# EAGLE design MRCS-ODX4 v17 (EAGLE 7.7.0)
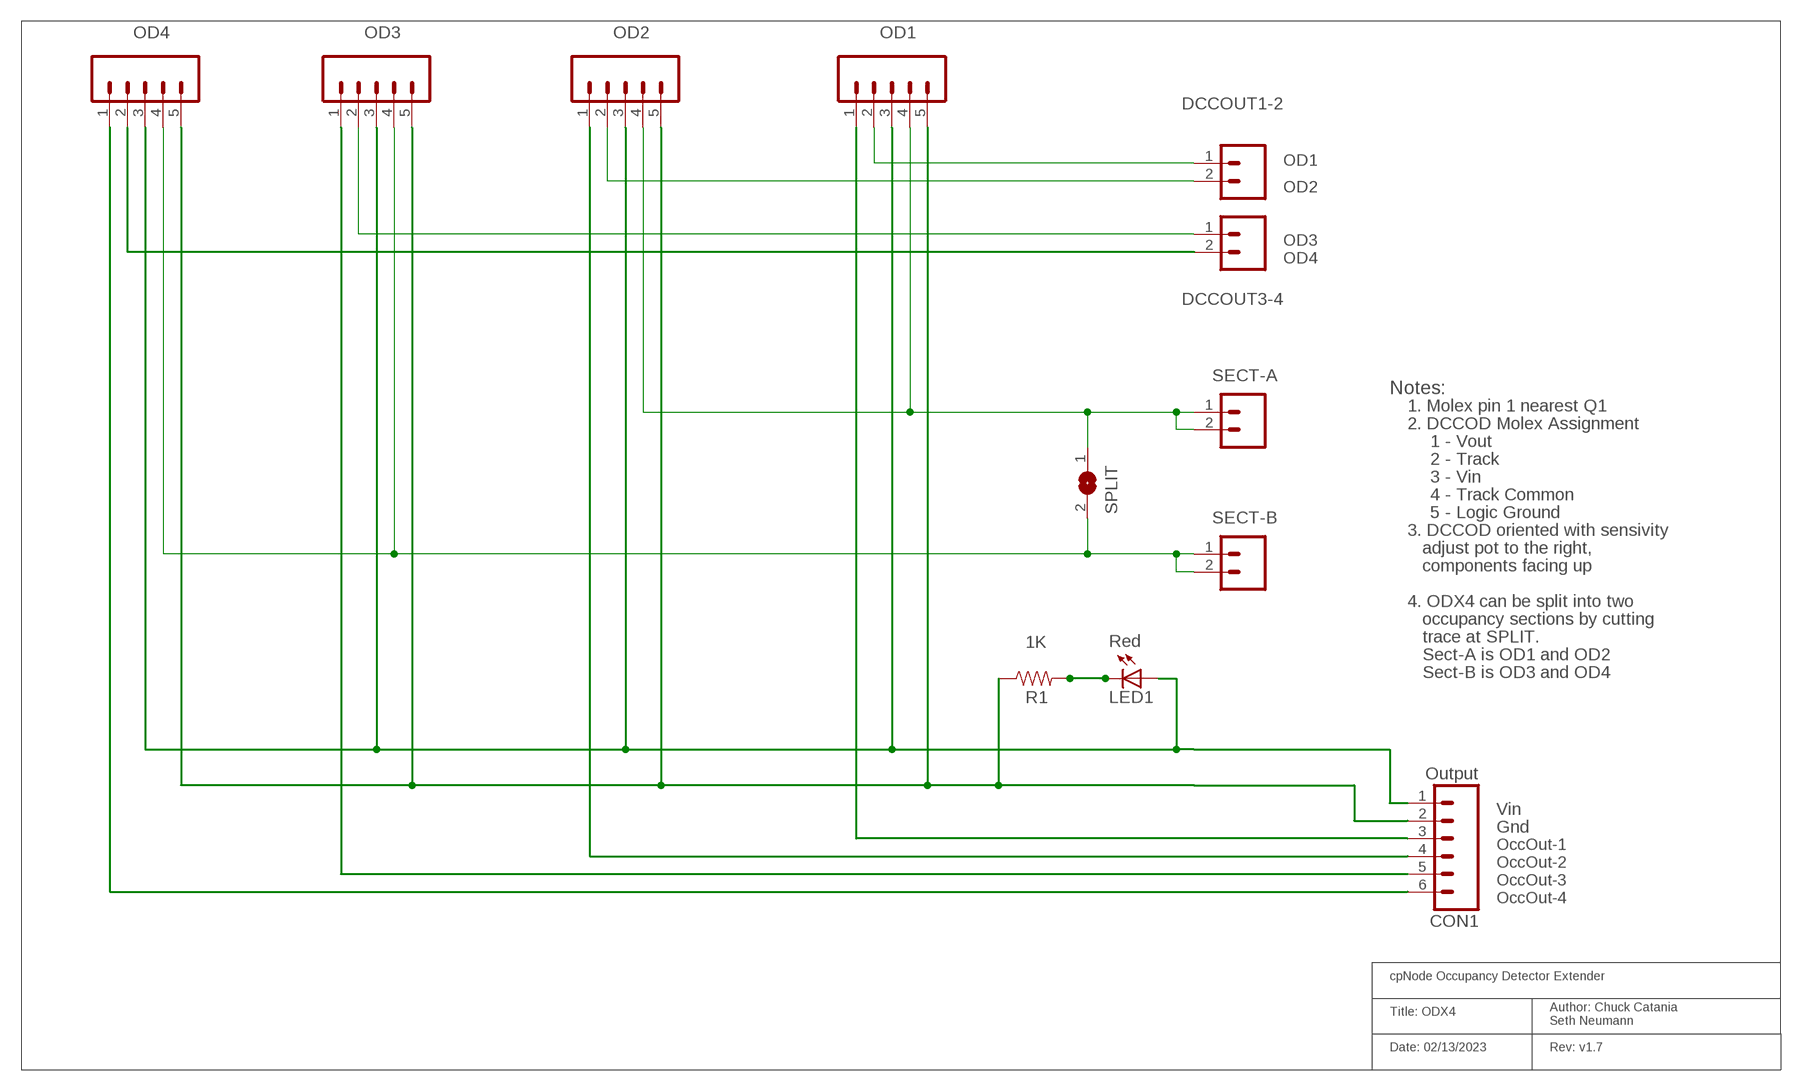
[diagram p0: schematic, sheet 1]

## Parts
CON1  Output  CONNECTOR-M06POLAR_LOCK  [MOLEX-1X6_LOCK]
DCCOUT1-2  CONNECTOR-M025MM-LOCK  [SCREWTERMINAL-5MM-2]
DCCOUT3-4  CONNECTOR-M025MM-LOCK  [SCREWTERMINAL-5MM-2]
LED1  Red  LEDLED3MM  [LED3MM]
OD1  M05PTH_LONGPADS  [1X05_LONGPADS]
OD2  M05PTH_LONGPADS  [1X05_LONGPADS]
OD3  M05PTH_LONGPADS  [1X05_LONGPADS]
OD4  M05PTH_LONGPADS  [1X05_LONGPADS]
R1  1K  RPTH04  [AXIAL-0.4-RES]
SECT-A  M025MM  [SCREWTERMINAL-5MM-2]
SECT-B  M025MM  [SCREWTERMINAL-5MM-2]
SPLIT  SJW  [SJW]

## Nets
GND: CON1.2 OD1.5 OD2.5 OD3.5 OD4.5 R1.P$1
N$1: DCCOUT3-4.2(B) OD4.2
N$2: CON1.3 OD1.1
N$3: DCCOUT1-2.1(A) OD1.2
N$4: DCCOUT1-2.2(B) OD2.2
N$6: LED1.K(C) R1.P$2
N$7: CON1.6 OD4.1
N$11: OD3.4 OD4.4 SECT-B.1 SECT-B.2 SPLIT.2
N$12: OD1.4 OD2.4 SECT-A.1 SECT-A.2 SPLIT.1
N$13: CON1.4 OD2.1
N$14: DCCOUT3-4.1(A) OD3.2
N$15: CON1.5 OD3.1
VIN: CON1.1 LED1.A OD1.3 OD2.3 OD3.3 OD4.3

## Notes on the sheet
- OD1
- OD2
- OD3
- OD4
- Notes:
- 1. Molex pin 1 nearest Q1
- 2. DCCOD Molex Assignment
- 1 - Vout
- 2 - Track
- 3 - Vin
- 4 - Track Common
- 5 - Logic Ground
- 3. DCCOD oriented with sensivity
- adjust pot to the right,
- components facing up
- 4. ODX4 can be split into two
- occupancy sections by cutting
- trace at SPLIT.
- Sect-A is OD1 and OD2
- Sect-B is OD3 and OD4
- Vin
- Gnd
- OccOut-1
- OccOut-2
- OccOut-3
- OccOut-4
- cpNode Occupancy Detector Extender
- Title: ODX4
- Author: Chuck Catania
  Seth Neumann
- Date: 02/13/2023 | Rev: v1.7

## Library data of the parts
CON1 = SPCoast:CONNECTOR-M06: Header 6 Standard 6-pin 0.1" header
DCCOUT1-2 DCCOUT3-4 = SPCoast:CONNECTOR-M02: PHOENIX CONNECTOR
LED1 = SPCoast:LED*
OD1-OD4 = SparkFun:M05: Header 5 Standard 5-pin 0.1" header. Use with straight break away headers (SKU : PRT-00116), right angle break away headers (PRT-00553), swiss pins (PRT-00743), machine pins (PRT-00117), and female headers (PRT-00115). Molex polarized connector foot print use with SKU : PRT-08230 with associated crimp pins and housings.
R1 = SPCoast:R*: Resistor Basic schematic elements and footprints for 0603, 1206, and PTH 1/10th watt (small) resistors.
SECT-A SECT-B = SparkFun-Connectors:M02: Standard 2-pin 0.1" header. Use with - straight break away headers ( PRT-00116) - right angle break away headers (PRT-00553) - swiss pins (PRT-00743) - machine pins (PRT-00117) - female headers (PRT-00115) Molex polarized connector foot print use with: PRT-08233 with associated crimp pins and housings. 2.54_SCREWTERM for use with PRT-10571. 3.5mm Screw Terminal footprints for PRT-08084 5mm Screw Terminal footprints for use with PRT-08433
SPLIT = jumper:SJ: SMD solder JUMPER

## Board
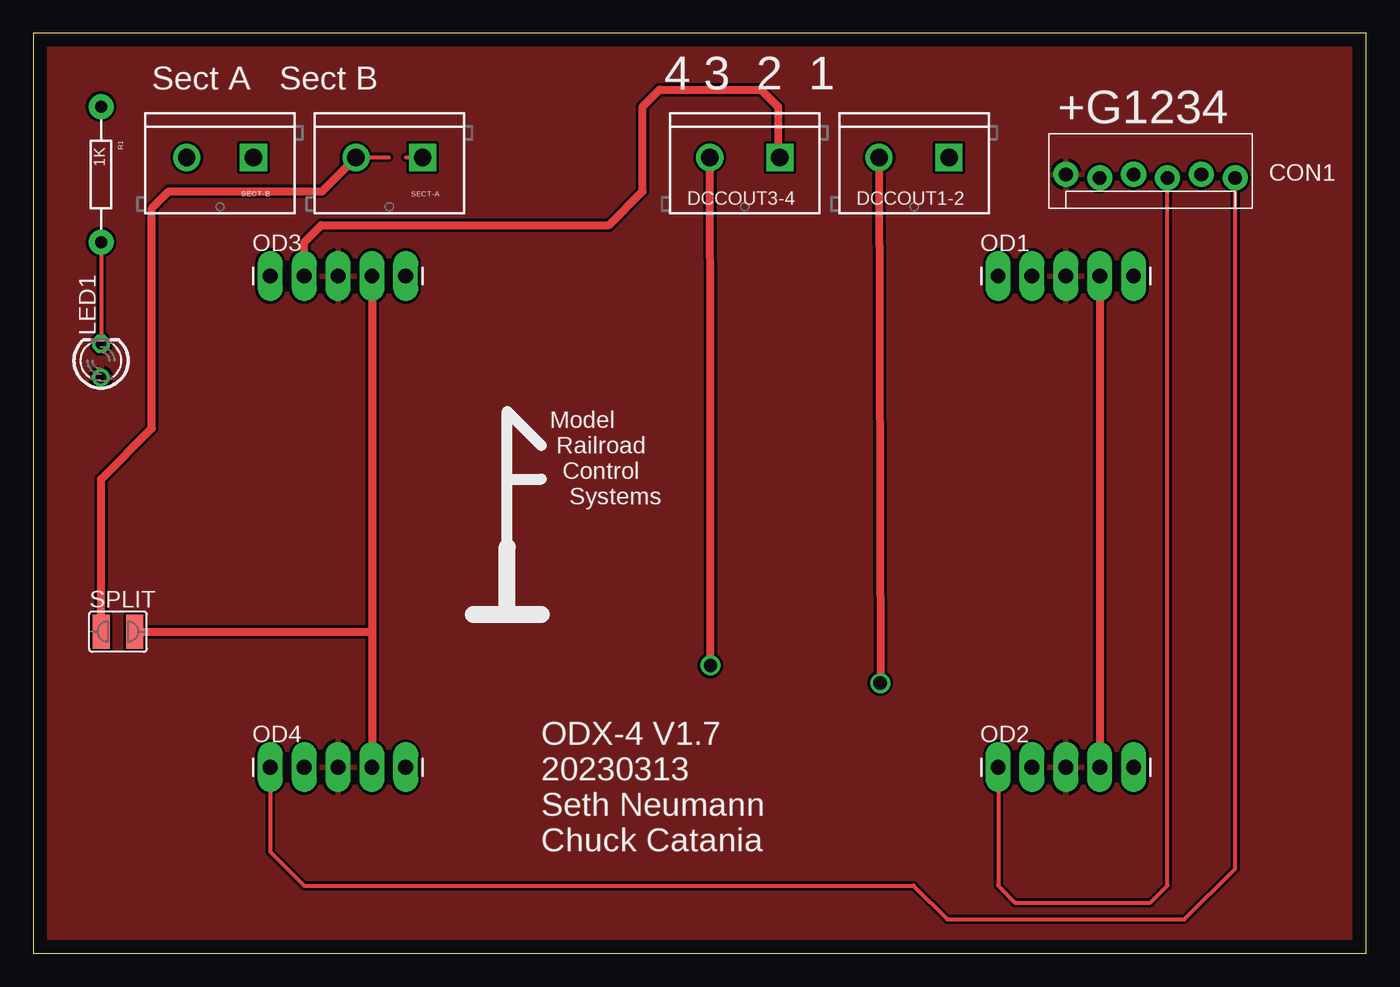
[diagram p1: board, top side]
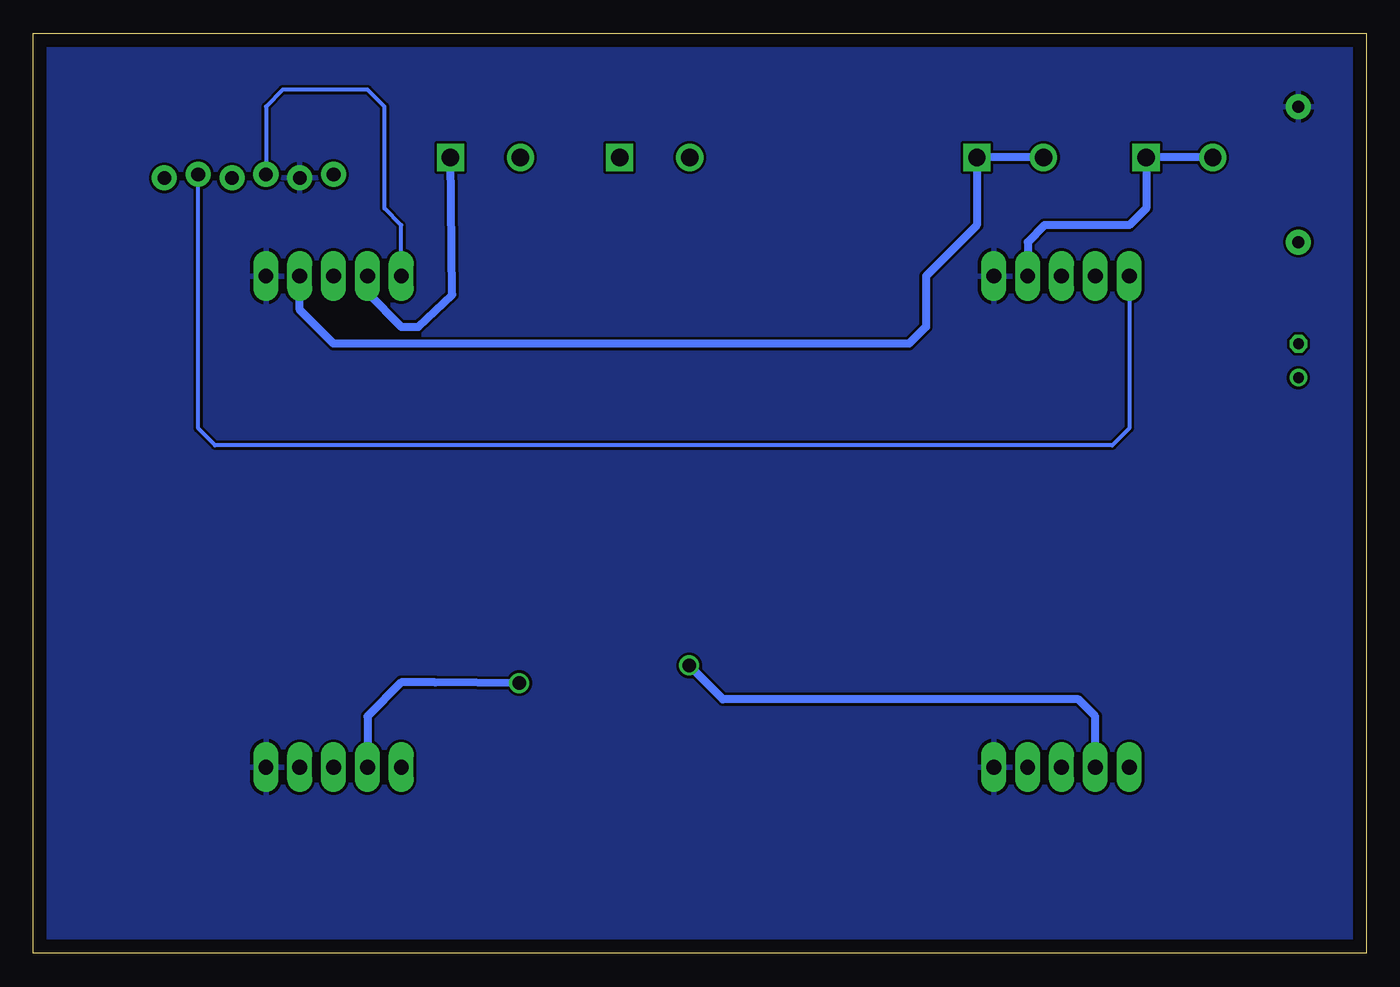
[diagram p2: board, bottom side, seen from below]

Size 100 x 69 mm. Coordinates in mm from the lower left corner, seen from the top.
Outline: 0,0 100,0 100,69 0,69 0,0
Copper layers (1*16): Top 0.035mm / dielectric 1.5mm / Bottom 0.035mm
Design rules "default": minimum track width 10mil, minimum drill 24mil, track to track 8mil, track to pad 8mil, pad to pad 8mil, via to via 8mil, smd to smd 8mil, copper to edge 40mil, drill to drill 8mil, minimum pad ring 10mil, minimum via ring 8mil, stop-mask expansion 4mil, vias tented up to drill 0mil, thermal gap 10mil

### Footprints (pad centres in the part's own frame; a part is rotated, then mirrored left to right if it is on the bottom)
MOLEX-1X6_LOCK = drill 1.016 pad 1.88: 1 0,0; 2 2.54,-0.254; 3 5.08,0; 4 7.62,-0.254; 5 10.16,0; 6 12.7,-0.254
SCREWTERMINAL-5MM-2 = drill 1.3 pad 2.032 square: 1 -0.127,0 | drill 1.3 pad 2.032: 2 5.127,0
LED3MM = drill 0.813: A 1.27,0 | drill 0.813 octagon: K -1.27,0
1X05_LONGPADS = drill 1.118 pad 1.88 long: 1 0,0; 2 2.54,0; 3 5.08,0; 4 7.62,0; 5 10.16,0
AXIAL-0.4-RES = drill 0.9 pad 1.88: P$1 -5.08,0; P$2 5.08,0
SCREWTERMINAL-5MM-2' = drill 1.3 pad 2.032 square: 1 0,0 | drill 1.3 pad 2.032: 2 5,0
SJW = smd 1.27 x 2.54: 1 -1.27,0; 2 1.27,0

### Placement (x,y rotation side)
CON1  77.47,58.42 0 top
DCCOUT1-2  68.58,59.69 180 top
DCCOUT3-4  55.88,59.69 180 top
LED1  5.08,44.45 270 top
OD1  72.39,50.8 0 top
OD2  72.39,13.97 0 top
OD3  17.78,50.8 0 top
OD4  17.78,13.97 0 top
R1  5.08,58.42 270 top
SECT-A  M025MM  [SCREWTERMINAL-5MM-2']  29.21,59.69 180 top
SECT-B  M025MM  [SCREWTERMINAL-5MM-2']  16.51,59.69 180 top
SPLIT  6.35,24.13 0 top
U$1  [MRCS-LOGO]  35.56,25.4 0 top

### Tracks (layer width: path | path; a pad name or v marks a point on that pad's centre or on a via)
GND
  pour Bottom: 0,0 100.33,0 100.33,68.58 0,68.58
N$1  (via drill 1)
  Top 0.61: v50.8,21.59 50.8,44.4 DCCOUT3-4.2
  Bottom 0.61: OD4.2 20.32,17.78 21.59,19.05 48.26,19.05 v50.8,21.59
N$2
  Bottom 0.305: OD1.1 72.39,54.61 73.66,55.88 73.66,63.5 74.93,64.77 81.28,64.77 82.55,63.5 CON1.3
N$3
  Bottom 0.61: OD1.2 74.93,49.53 72.39,46.99 71.12,46.99 68.58,49.4 DCCOUT1-2.1
N$4  (via drill 1)
  Top 0.61: DCCOUT1-2.2 v63.55,20.27
  Bottom 0.61: v63.55,20.27 69.85,20.32 72.39,20.32 74.93,17.78 OD2.2
N$6
  Top 0.305: R1.P$2 LED1.K
N$7
  Top 0.305: OD4.1 17.78,7.62 20.32,5.08 66.04,5.08 68.58,2.54 86.36,2.54 90.17,6.35 CON1.6
N$11
  Top 0.61: OD3.4 25.4,24.13 | 25.4,24.13 OD4.4 | SPLIT.2 25.4,24.13
  Bottom 0.61: SECT-B.2 SECT-B.1 16.51,55.88 17.78,54.61 24.13,54.61 25.4,53.34 OD3.4
N$12
  Top 0.305: 27.94,59.69 SECT-A.1 | SECT-A.2 26.67,59.69
  Top 0.61: OD1.4 OD2.4 | SPLIT.1 5.08,35.56 8.89,39.37 8.89,55.88 10.16,57.15 21.67,57.15 SECT-A.2
  Bottom 0.61: SECT-A.2 SECT-A.1 29.21,54.61 33.02,50.8 33.02,46.99 34.29,45.72 77.47,45.72 80.01,48.26 OD1.4
N$13
  Top 0.305: OD2.1 72.39,5.08 73.66,3.81 83.82,3.81 85.09,5.08 CON1.4
N$14
  Top 0.61: OD3.2 20.32,53.34 21.59,54.61 43.18,54.61 45.72,57.15 45.72,63.5 46.99,64.77 54.61,64.77 55.88,63.5 55.88,59.82 DCCOUT3-4.1
N$15
  Bottom 0.305: OD3.1 17.78,39.37 19.05,38.1 86.36,38.1 87.63,39.37 CON1.5
VIN
  pour Top: 0,0 100.33,0 100.33,68.58 0,68.58

### Text on the board
tPlace: Sect A Sect B | 4 3 2 1 | +G1234 | ODX-4 V1.7 / 20230313 / Seth Neumann / Chuck Catania